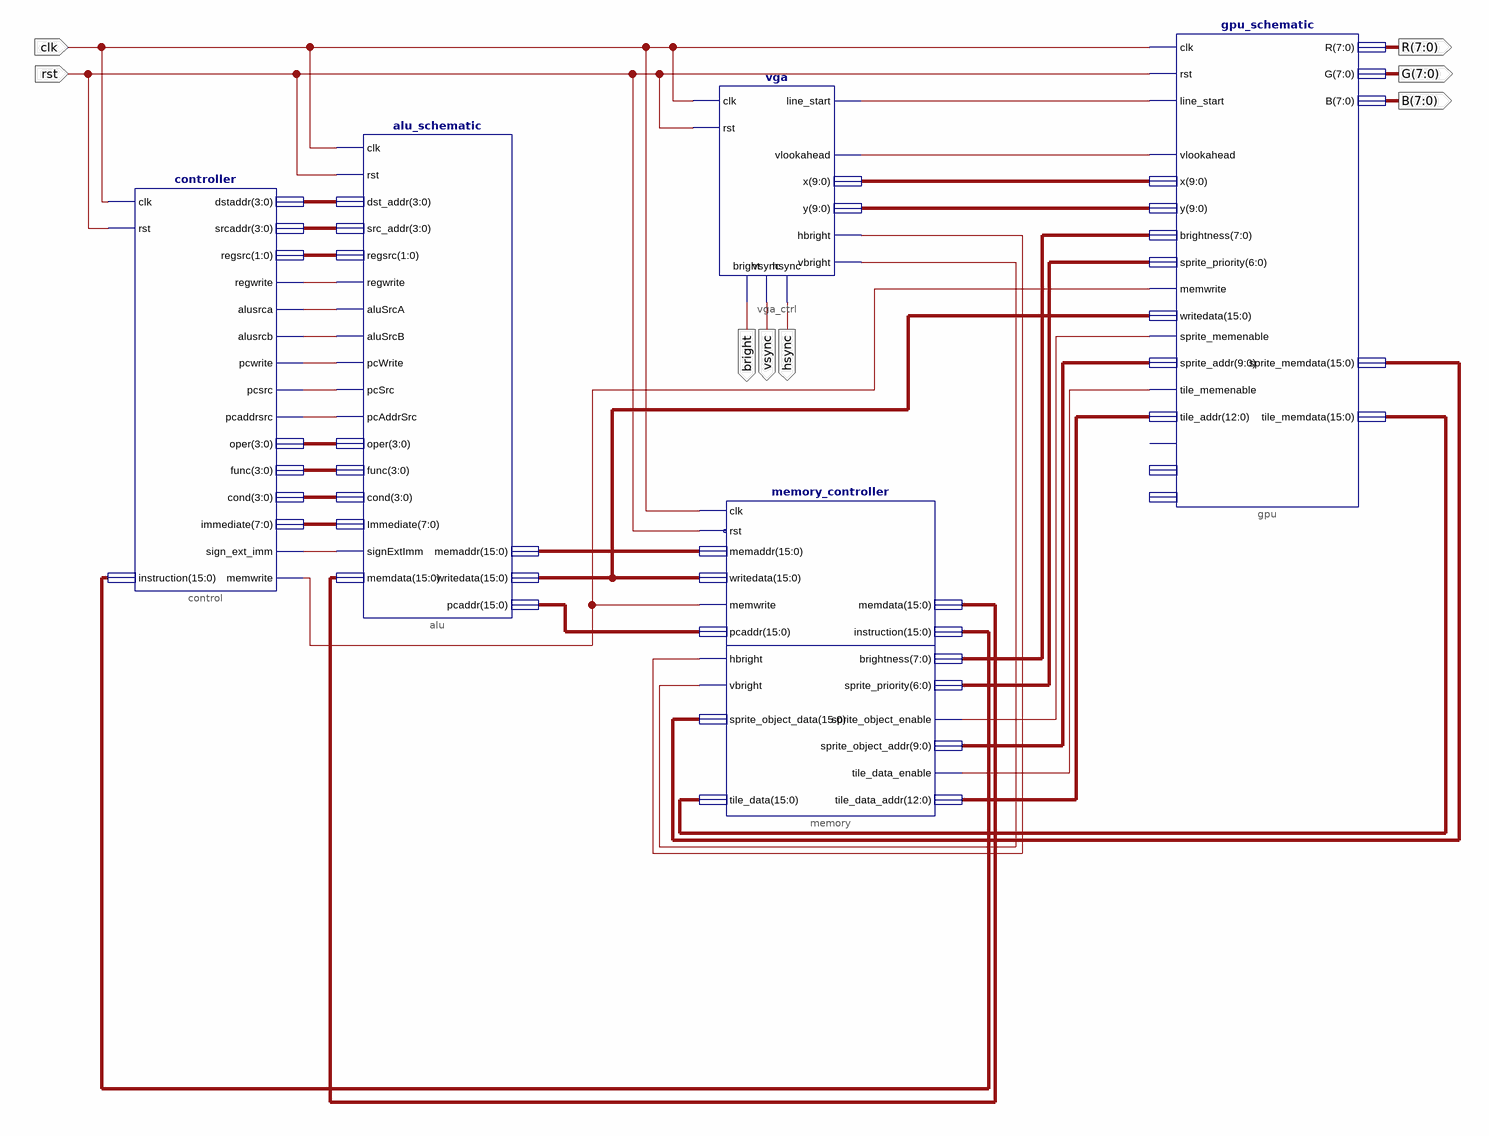
[diagram p0: schematic sheet 1]
// Xilinx ISE schematic system.sch (spartan3e) as structural Verilog: 5 symbols, 8 ports
module system (
  input  rst,
  input  clk,
  output vsync,
  output hsync,
  output bright,
  output [7:0] R,
  output [7:0] B,
  output [7:0] G
);

  wire hbright, vbright, XLXN_26, XLXN_28, XLXN_231, XLXN_233, XLXN_277, XLXN_278, XLXN_279, XLXN_280,
       XLXN_281, XLXN_282, XLXN_287, XLXN_417;
  wire [1:0] XLXN_276;
  wire [3:0] XLXN_274, XLXN_275, XLXN_283, XLXN_284, XLXN_285;
  wire [6:0] XLXN_228;
  wire [7:0] XLXN_227, XLXN_286;
  wire [9:0] XLXN_15, XLXN_17, XLXN_232;
  wire [12:0] XLXN_234;
  wire [15:0] XLXN_223, XLXN_224, XLXN_288, XLXN_290, XLXN_294, XLXN_415, XLXN_416;

  memory_controller memory (
    .hbright(hbright), .vbright(vbright), .brightness(XLXN_227), .sprite_priority(XLXN_228),
    .tile_data_addr(XLXN_234), .tile_data_enable(XLXN_233), .sprite_object_addr(XLXN_232),
    .sprite_object_enable(XLXN_231), .tile_data(XLXN_223), .sprite_object_data(XLXN_224),
    .instruction(XLXN_290), .pcaddr(XLXN_294), .memdata(XLXN_288), .rst(rst), .clk(clk), .memwrite(XLXN_417),
    .memaddr(XLXN_416), .writedata(XLXN_415));
  controller control (
    .clk(clk), .instruction(XLXN_290), .dstaddr(XLXN_274), .srcaddr(XLXN_275), .regsrc(XLXN_276),
    .regwrite(XLXN_277), .alusrca(XLXN_278), .alusrcb(XLXN_279), .rst(rst), .pcwrite(XLXN_280),
    .pcsrc(XLXN_281), .pcaddrsrc(XLXN_282), .oper(XLXN_283), .func(XLXN_284), .cond(XLXN_285),
    .immediate(XLXN_286), .sign_ext_imm(XLXN_287), .memwrite(XLXN_417));
  alu_schematic alu (
    .clk(clk), .rst(rst), .memdata(XLXN_288), .src_addr(XLXN_275), .regsrc(XLXN_276), .regwrite(XLXN_277),
    .aluSrcB(XLXN_279), .aluSrcA(XLXN_278), .pcWrite(XLXN_280), .pcSrc(XLXN_281), .dst_addr(XLXN_274),
    .pcAddrSrc(XLXN_282), .oper(XLXN_283), .func(XLXN_284), .cond(XLXN_285), .Immediate(XLXN_286),
    .signExtImm(XLXN_287), .writedata(XLXN_415), .pcaddr(XLXN_294), .memaddr(XLXN_416));
  vga vga_ctrl (
    .clk(clk), .rst(rst), .bright(bright), .vsync(vsync), .hsync(hsync), .vlookahead(XLXN_28),
    .line_start(XLXN_26), .x(XLXN_15), .y(XLXN_17), .vbright(vbright), .hbright(hbright));
  gpu_schematic gpu (
    .clk(clk), .x(XLXN_15), .y(XLXN_17), .line_start(XLXN_26), .brightness(XLXN_227),
    .sprite_priority(XLXN_228), .tile_addr(XLXN_234), .tile_memenable(XLXN_233), .tile_memdata(XLXN_223),
    .sprite_memdata(XLXN_224), .sprite_addr(XLXN_232), .sprite_memenable(XLXN_231), .writedata(XLXN_415),
    .memwrite(XLXN_417), .rst(rst), .B(B), .G(G), .R(R), .vlookahead(XLXN_28));  // open: palette_write, palette_wrindex, palette_data
endmodule
